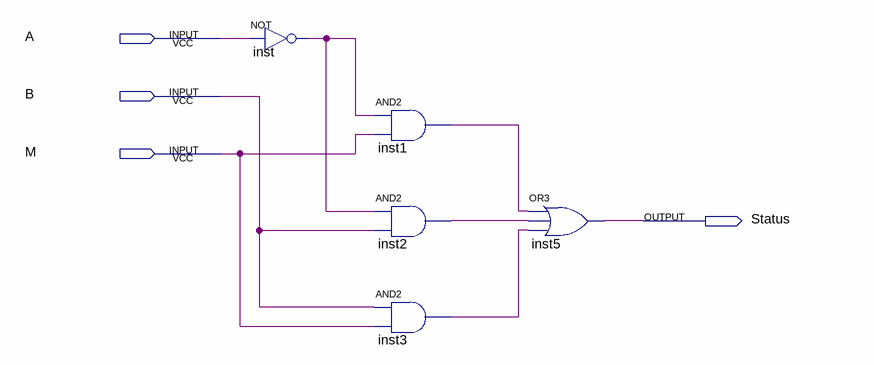
[diagram p0: schematic sheet]
// Quartus schematic a-maior-b-bit-sinal.bdf as structural Verilog: 5 symbols, 4 pins
module \a-maior-b-bit-sinal  (
  input  A,
  input  B,
  input  M,
  output Status
);

  wire inst1_out, inst2_out, inst3_out, inst_out;

  not inst (inst_out, A);
  and inst1 (inst1_out, inst_out, M);
  and inst2 (inst2_out, inst_out, B);
  and inst3 (inst3_out, B, M);
  or inst5 (Status, inst1_out, inst2_out, inst3_out);
endmodule
